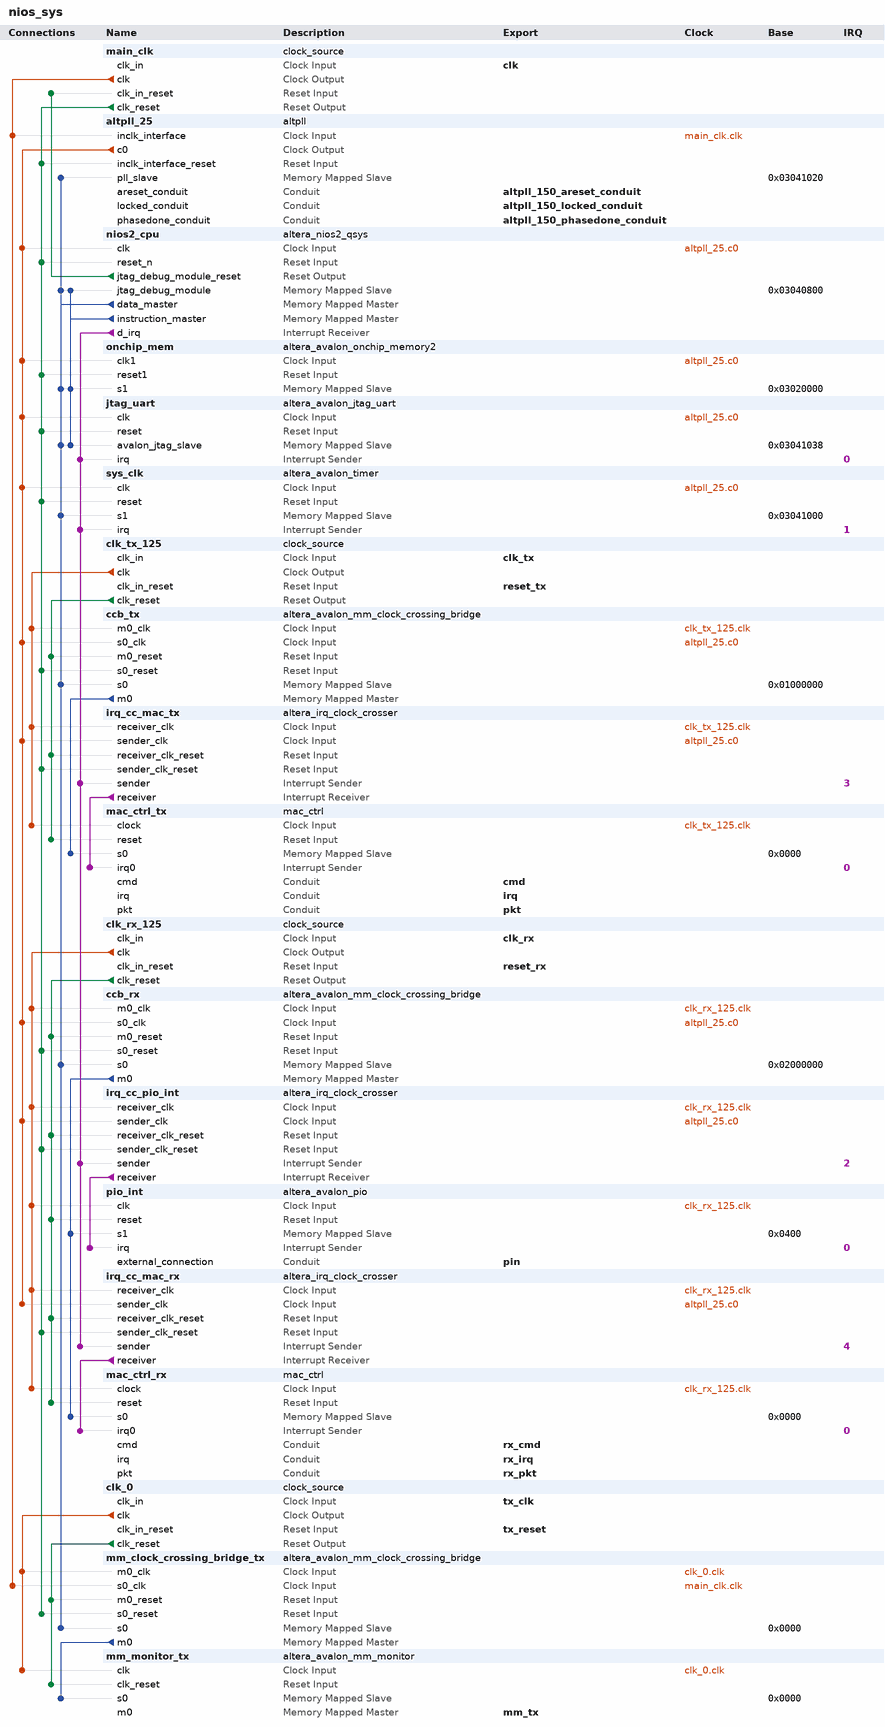
[diagram p0: system contents]
# Platform Designer (Qsys) system nios_sys, Cyclone III EP3C40F484I7
# Parameters at their usual value, and those the tool derives, are not listed.
package require -exact qsys 13.1
create_system nios_sys
set_project_property DEVICE_FAMILY {Cyclone III}
set_project_property DEVICE EP3C40F484I7

add_instance main_clk clock_source 13.1
set_instance_parameter_value main_clk clockFrequency 50000000

add_instance altpll_25 altpll 13.1
set_instance_parameter_value altpll_25 INCLK0_INPUT_FREQUENCY 40000
set_instance_parameter_value altpll_25 CLK0_MULTIPLY_BY 3
set_instance_parameter_value altpll_25 CLK0_DIVIDE_BY 1
set_instance_parameter_value altpll_25 PORT_clk1 PORT_UNUSED
set_instance_parameter_value altpll_25 PORT_clk2 PORT_UNUSED
set_instance_parameter_value altpll_25 PORT_clk3 PORT_UNUSED
set_instance_parameter_value altpll_25 PORT_ARESET PORT_UNUSED
set_instance_parameter_value altpll_25 PORT_LOCKED PORT_USED

add_instance nios2_cpu altera_nios2_qsys 13.1
set_instance_parameter_value nios2_cpu setting_illegalInstructionsTrap true
set_instance_parameter_value nios2_cpu muldiv_divider true
set_instance_parameter_value nios2_cpu mpu_enabled true
set_instance_parameter_value nios2_cpu mmu_TLBMissExcOffset 64
set_instance_parameter_value nios2_cpu resetSlave onchip_mem.s1
set_instance_parameter_value nios2_cpu mmu_TLBMissExcSlave onchip_mem.s1
set_instance_parameter_value nios2_cpu exceptionSlave onchip_mem.s1
set_instance_parameter_value nios2_cpu breakSlave nios2_cpu.jtag_debug_module
set_instance_parameter_value nios2_cpu impl Tiny
set_instance_parameter_value nios2_cpu icache_size 4096

add_instance onchip_mem altera_avalon_onchip_memory2 13.1
set_instance_parameter_value onchip_mem dataWidth 32
set_instance_parameter_value onchip_mem dualPort false
set_instance_parameter_value onchip_mem initMemContent true
set_instance_parameter_value onchip_mem initializationFileName onchip_mem.hex
set_instance_parameter_value onchip_mem memorySize 80000

add_instance jtag_uart altera_avalon_jtag_uart 13.1
set_instance_parameter_value jtag_uart simInteractiveOptions NO_INTERACTIVE_WINDOWS

add_instance sys_clk altera_avalon_timer 13.1
set_instance_parameter_value sys_clk period 1
set_instance_parameter_value sys_clk periodUnits MSEC

add_instance clk_tx_125 clock_source 13.1
set_instance_parameter_value clk_tx_125 clockFrequency 125000000

add_instance ccb_tx altera_avalon_mm_clock_crossing_bridge 13.1
set_instance_parameter_value ccb_tx DATA_WIDTH 32
set_instance_parameter_value ccb_tx ADDRESS_WIDTH 12
set_instance_parameter_value ccb_tx MAX_BURST_SIZE 1
set_instance_parameter_value ccb_tx COMMAND_FIFO_DEPTH 4
set_instance_parameter_value ccb_tx RESPONSE_FIFO_DEPTH 4
set_instance_parameter_value ccb_tx MASTER_SYNC_DEPTH 2
set_instance_parameter_value ccb_tx SLAVE_SYNC_DEPTH 2

add_instance irq_cc_mac_tx altera_irq_clock_crosser 13.1
set_instance_parameter_value irq_cc_mac_tx IRQ_WIDTH 1

add_instance mac_ctrl_tx mac_ctrl 1.0

add_instance clk_rx_125 clock_source 13.1
set_instance_parameter_value clk_rx_125 clockFrequency 125000000

add_instance ccb_rx altera_avalon_mm_clock_crossing_bridge 13.1
set_instance_parameter_value ccb_rx DATA_WIDTH 32
set_instance_parameter_value ccb_rx ADDRESS_WIDTH 12
set_instance_parameter_value ccb_rx MAX_BURST_SIZE 1
set_instance_parameter_value ccb_rx COMMAND_FIFO_DEPTH 4
set_instance_parameter_value ccb_rx RESPONSE_FIFO_DEPTH 4
set_instance_parameter_value ccb_rx MASTER_SYNC_DEPTH 2
set_instance_parameter_value ccb_rx SLAVE_SYNC_DEPTH 2

add_instance irq_cc_pio_int altera_irq_clock_crosser 13.1
set_instance_parameter_value irq_cc_pio_int IRQ_WIDTH 1

add_instance pio_int altera_avalon_pio 13.1
set_instance_parameter_value pio_int captureEdge true
set_instance_parameter_value pio_int direction Input
set_instance_parameter_value pio_int generateIRQ true
set_instance_parameter_value pio_int irqType EDGE
set_instance_parameter_value pio_int simDoTestBenchWiring true
set_instance_parameter_value pio_int width 1

add_instance irq_cc_mac_rx altera_irq_clock_crosser 13.1
set_instance_parameter_value irq_cc_mac_rx IRQ_WIDTH 1

add_instance mac_ctrl_rx mac_ctrl 1.0

add_instance clk_0 clock_source 13.1
set_instance_parameter_value clk_0 clockFrequency 125000000

add_instance mm_clock_crossing_bridge_tx altera_avalon_mm_clock_crossing_bridge 13.1
set_instance_parameter_value mm_clock_crossing_bridge_tx DATA_WIDTH 32
set_instance_parameter_value mm_clock_crossing_bridge_tx ADDRESS_WIDTH 8
set_instance_parameter_value mm_clock_crossing_bridge_tx ADDRESS_UNITS WORDS
set_instance_parameter_value mm_clock_crossing_bridge_tx MAX_BURST_SIZE 1
set_instance_parameter_value mm_clock_crossing_bridge_tx COMMAND_FIFO_DEPTH 4
set_instance_parameter_value mm_clock_crossing_bridge_tx RESPONSE_FIFO_DEPTH 4
set_instance_parameter_value mm_clock_crossing_bridge_tx MASTER_SYNC_DEPTH 2
set_instance_parameter_value mm_clock_crossing_bridge_tx SLAVE_SYNC_DEPTH 2

add_instance mm_monitor_tx altera_avalon_mm_monitor 13.1
set_instance_parameter_value mm_monitor_tx AV_ADDRESS_W 8
set_instance_parameter_value mm_monitor_tx AV_SYMBOL_W 8
set_instance_parameter_value mm_monitor_tx AV_NUMSYMBOLS 4
set_instance_parameter_value mm_monitor_tx AV_BURSTCOUNT_W 3
set_instance_parameter_value mm_monitor_tx USE_READ 0
set_instance_parameter_value mm_monitor_tx USE_WRITE 1
set_instance_parameter_value mm_monitor_tx USE_ADDRESS 1
set_instance_parameter_value mm_monitor_tx USE_BYTE_ENABLE 0
set_instance_parameter_value mm_monitor_tx USE_BURSTCOUNT 0
set_instance_parameter_value mm_monitor_tx USE_READ_DATA 0
set_instance_parameter_value mm_monitor_tx USE_READ_DATA_VALID 0
set_instance_parameter_value mm_monitor_tx USE_WRITE_DATA 1
set_instance_parameter_value mm_monitor_tx USE_BEGIN_TRANSFER 0
set_instance_parameter_value mm_monitor_tx USE_BEGIN_BURST_TRANSFER 0
set_instance_parameter_value mm_monitor_tx USE_WAIT_REQUEST 0
set_instance_parameter_value mm_monitor_tx AV_CONSTANT_BURST_BEHAVIOR 0
set_instance_parameter_value mm_monitor_tx AV_BURST_LINEWRAP 0
set_instance_parameter_value mm_monitor_tx AV_BURST_BNDR_ONLY 0
set_instance_parameter_value mm_monitor_tx AV_READ_TIMEOUT 100
set_instance_parameter_value mm_monitor_tx AV_WRITE_TIMEOUT 100
set_instance_parameter_value mm_monitor_tx AV_WAITREQUEST_TIMEOUT 1024
set_instance_parameter_value mm_monitor_tx AV_MAX_PENDING_READS 1
set_instance_parameter_value mm_monitor_tx AV_MAX_PENDING_WRITES 0
set_instance_parameter_value mm_monitor_tx AV_FIX_READ_LATENCY 0
set_instance_parameter_value mm_monitor_tx AV_MAX_READ_LATENCY 100
set_instance_parameter_value mm_monitor_tx AV_MAX_WAITREQUESTED_READ 100
set_instance_parameter_value mm_monitor_tx AV_MAX_WAITREQUESTED_WRITE 100
set_instance_parameter_value mm_monitor_tx MASTER_ADDRESS_TYPE SYMBOLS
set_instance_parameter_value mm_monitor_tx SLAVE_ADDRESS_TYPE WORDS
set_instance_parameter_value mm_monitor_tx VHDL_ID 0
set_instance_parameter_value mm_monitor_tx AV_READRESPONSE_W 8
set_instance_parameter_value mm_monitor_tx AV_WRITERESPONSE_W 8
set_instance_parameter_value mm_monitor_tx USE_ARBITERLOCK 0
set_instance_parameter_value mm_monitor_tx USE_LOCK 0
set_instance_parameter_value mm_monitor_tx USE_DEBUGACCESS 0
set_instance_parameter_value mm_monitor_tx USE_TRANSACTIONID 0
set_instance_parameter_value mm_monitor_tx USE_WRITERESPONSE 0
set_instance_parameter_value mm_monitor_tx USE_READRESPONSE 0
set_instance_parameter_value mm_monitor_tx USE_CLKEN 0
set_instance_parameter_value mm_monitor_tx AV_MAX_CONTINUOUS_READ 5
set_instance_parameter_value mm_monitor_tx AV_MAX_CONTINUOUS_WRITE 5
set_instance_parameter_value mm_monitor_tx AV_MAX_CONTINUOUS_WAITREQUEST 5
set_instance_parameter_value mm_monitor_tx AV_MAX_CONTINUOUS_READDATAVALID 5
set_instance_parameter_value mm_monitor_tx AV_READ_WAIT_TIME 1
set_instance_parameter_value mm_monitor_tx AV_WRITE_WAIT_TIME 0
set_instance_parameter_value mm_monitor_tx REGISTER_WAITREQUEST 0
set_instance_parameter_value mm_monitor_tx AV_REGISTERINCOMINGSIGNALS 0

# connections
add_connection altpll_25.c0 ccb_rx.s0_clk clock
add_connection altpll_25.c0 ccb_tx.s0_clk clock
add_connection altpll_25.c0 irq_cc_mac_rx.sender_clk clock
add_connection altpll_25.c0 irq_cc_mac_tx.sender_clk clock
add_connection altpll_25.c0 irq_cc_pio_int.sender_clk clock
add_connection altpll_25.c0 jtag_uart.clk clock
add_connection altpll_25.c0 nios2_cpu.clk clock
add_connection altpll_25.c0 onchip_mem.clk1 clock
add_connection altpll_25.c0 sys_clk.clk clock
add_connection clk_0.clk mm_clock_crossing_bridge_tx.m0_clk clock
add_connection clk_0.clk mm_monitor_tx.clk clock
add_connection clk_rx_125.clk ccb_rx.m0_clk clock
add_connection clk_rx_125.clk irq_cc_mac_rx.receiver_clk clock
add_connection clk_rx_125.clk irq_cc_pio_int.receiver_clk clock
add_connection clk_rx_125.clk mac_ctrl_rx.clock clock
add_connection clk_rx_125.clk pio_int.clk clock
add_connection clk_tx_125.clk ccb_tx.m0_clk clock
add_connection clk_tx_125.clk irq_cc_mac_tx.receiver_clk clock
add_connection clk_tx_125.clk mac_ctrl_tx.clock clock
add_connection main_clk.clk altpll_25.inclk_interface clock
add_connection main_clk.clk mm_clock_crossing_bridge_tx.s0_clk clock
add_connection clk_0.clk_reset mm_clock_crossing_bridge_tx.m0_reset reset
add_connection clk_0.clk_reset mm_monitor_tx.clk_reset reset
add_connection clk_rx_125.clk_reset ccb_rx.m0_reset reset
add_connection clk_rx_125.clk_reset irq_cc_mac_rx.receiver_clk_reset reset
add_connection clk_rx_125.clk_reset irq_cc_pio_int.receiver_clk_reset reset
add_connection clk_rx_125.clk_reset mac_ctrl_rx.reset reset
add_connection clk_rx_125.clk_reset pio_int.reset reset
add_connection clk_tx_125.clk_reset ccb_tx.m0_reset reset
add_connection clk_tx_125.clk_reset irq_cc_mac_tx.receiver_clk_reset reset
add_connection clk_tx_125.clk_reset mac_ctrl_tx.reset reset
add_connection main_clk.clk_reset altpll_25.inclk_interface_reset reset
add_connection main_clk.clk_reset ccb_rx.s0_reset reset
add_connection main_clk.clk_reset ccb_tx.s0_reset reset
add_connection main_clk.clk_reset irq_cc_mac_rx.sender_clk_reset reset
add_connection main_clk.clk_reset irq_cc_mac_tx.sender_clk_reset reset
add_connection main_clk.clk_reset irq_cc_pio_int.sender_clk_reset reset
add_connection main_clk.clk_reset jtag_uart.reset reset
add_connection main_clk.clk_reset mm_clock_crossing_bridge_tx.s0_reset reset
add_connection main_clk.clk_reset nios2_cpu.reset_n reset
add_connection main_clk.clk_reset onchip_mem.reset1 reset
add_connection main_clk.clk_reset sys_clk.reset reset
add_connection nios2_cpu.jtag_debug_module_reset main_clk.clk_in_reset reset
add_connection ccb_rx.m0 mac_ctrl_rx.s0 avalon
set_connection_parameter_value ccb_rx.m0/mac_ctrl_rx.s0 baseAddress 0x0000
add_connection ccb_rx.m0 pio_int.s1 avalon
set_connection_parameter_value ccb_rx.m0/pio_int.s1 baseAddress 0x0400
add_connection ccb_tx.m0 mac_ctrl_tx.s0 avalon
set_connection_parameter_value ccb_tx.m0/mac_ctrl_tx.s0 baseAddress 0x0000
add_connection mm_clock_crossing_bridge_tx.m0 mm_monitor_tx.s0 avalon
set_connection_parameter_value mm_clock_crossing_bridge_tx.m0/mm_monitor_tx.s0 baseAddress 0x0000
add_connection nios2_cpu.data_master altpll_25.pll_slave avalon
set_connection_parameter_value nios2_cpu.data_master/altpll_25.pll_slave baseAddress 0x03041020
add_connection nios2_cpu.data_master ccb_rx.s0 avalon
set_connection_parameter_value nios2_cpu.data_master/ccb_rx.s0 baseAddress 0x02000000
add_connection nios2_cpu.data_master ccb_tx.s0 avalon
set_connection_parameter_value nios2_cpu.data_master/ccb_tx.s0 baseAddress 0x01000000
add_connection nios2_cpu.data_master jtag_uart.avalon_jtag_slave avalon
set_connection_parameter_value nios2_cpu.data_master/jtag_uart.avalon_jtag_slave baseAddress 0x03041038
add_connection nios2_cpu.data_master mm_clock_crossing_bridge_tx.s0 avalon
set_connection_parameter_value nios2_cpu.data_master/mm_clock_crossing_bridge_tx.s0 baseAddress 0x0000
add_connection nios2_cpu.data_master nios2_cpu.jtag_debug_module avalon
set_connection_parameter_value nios2_cpu.data_master/nios2_cpu.jtag_debug_module baseAddress 0x03040800
add_connection nios2_cpu.data_master onchip_mem.s1 avalon
set_connection_parameter_value nios2_cpu.data_master/onchip_mem.s1 baseAddress 0x03020000
add_connection nios2_cpu.data_master sys_clk.s1 avalon
set_connection_parameter_value nios2_cpu.data_master/sys_clk.s1 baseAddress 0x03041000
add_connection nios2_cpu.instruction_master jtag_uart.avalon_jtag_slave avalon
set_connection_parameter_value nios2_cpu.instruction_master/jtag_uart.avalon_jtag_slave baseAddress 0x03041038
add_connection nios2_cpu.instruction_master nios2_cpu.jtag_debug_module avalon
set_connection_parameter_value nios2_cpu.instruction_master/nios2_cpu.jtag_debug_module baseAddress 0x03040800
add_connection nios2_cpu.instruction_master onchip_mem.s1 avalon
set_connection_parameter_value nios2_cpu.instruction_master/onchip_mem.s1 baseAddress 0x03020000
add_connection irq_cc_mac_rx.receiver mac_ctrl_rx.irq0 interrupt
set_connection_parameter_value irq_cc_mac_rx.receiver/mac_ctrl_rx.irq0 irqNumber 0
add_connection irq_cc_mac_tx.receiver mac_ctrl_tx.irq0 interrupt
set_connection_parameter_value irq_cc_mac_tx.receiver/mac_ctrl_tx.irq0 irqNumber 0
add_connection irq_cc_pio_int.receiver pio_int.irq interrupt
set_connection_parameter_value irq_cc_pio_int.receiver/pio_int.irq irqNumber 0
add_connection nios2_cpu.d_irq irq_cc_mac_rx.sender interrupt
set_connection_parameter_value nios2_cpu.d_irq/irq_cc_mac_rx.sender irqNumber 4
add_connection nios2_cpu.d_irq irq_cc_mac_tx.sender interrupt
set_connection_parameter_value nios2_cpu.d_irq/irq_cc_mac_tx.sender irqNumber 3
add_connection nios2_cpu.d_irq irq_cc_pio_int.sender interrupt
set_connection_parameter_value nios2_cpu.d_irq/irq_cc_pio_int.sender irqNumber 2
add_connection nios2_cpu.d_irq jtag_uart.irq interrupt
set_connection_parameter_value nios2_cpu.d_irq/jtag_uart.irq irqNumber 0
add_connection nios2_cpu.d_irq sys_clk.irq interrupt
set_connection_parameter_value nios2_cpu.d_irq/sys_clk.irq irqNumber 1

# exported interfaces
add_interface clk clock sink
set_interface_property clk EXPORT_OF main_clk.clk_in
add_interface altpll_150_areset_conduit conduit end
set_interface_property altpll_150_areset_conduit EXPORT_OF altpll_25.areset_conduit
add_interface altpll_150_locked_conduit conduit end
set_interface_property altpll_150_locked_conduit EXPORT_OF altpll_25.locked_conduit
add_interface altpll_150_phasedone_conduit conduit end
set_interface_property altpll_150_phasedone_conduit EXPORT_OF altpll_25.phasedone_conduit
add_interface cmd conduit end
set_interface_property cmd EXPORT_OF mac_ctrl_tx.cmd
add_interface pkt conduit end
set_interface_property pkt EXPORT_OF mac_ctrl_tx.pkt
add_interface irq conduit end
set_interface_property irq EXPORT_OF mac_ctrl_tx.irq
add_interface pin conduit end
set_interface_property pin EXPORT_OF pio_int.external_connection
add_interface clk_tx clock sink
set_interface_property clk_tx EXPORT_OF clk_tx_125.clk_in
add_interface reset_tx reset sink
set_interface_property reset_tx EXPORT_OF clk_tx_125.clk_in_reset
add_interface clk_rx clock sink
set_interface_property clk_rx EXPORT_OF clk_rx_125.clk_in
add_interface reset_rx reset sink
set_interface_property reset_rx EXPORT_OF clk_rx_125.clk_in_reset
add_interface rx_cmd conduit end
set_interface_property rx_cmd EXPORT_OF mac_ctrl_rx.cmd
add_interface rx_pkt conduit end
set_interface_property rx_pkt EXPORT_OF mac_ctrl_rx.pkt
add_interface rx_irq conduit end
set_interface_property rx_irq EXPORT_OF mac_ctrl_rx.irq
add_interface mm_tx avalon master
set_interface_property mm_tx EXPORT_OF mm_monitor_tx.m0
add_interface tx_clk clock sink
set_interface_property tx_clk EXPORT_OF clk_0.clk_in
add_interface tx_reset reset sink
set_interface_property tx_reset EXPORT_OF clk_0.clk_in_reset

set_interconnect_requirement {$system} qsys_mm.clockCrossingAdapter HANDSHAKE
set_interconnect_requirement {$system} qsys_mm.maxAdditionalLatency 1
set_interconnect_requirement {$system} qsys_mm.insertDefaultSlave false

save_system nios_sys.qsys
